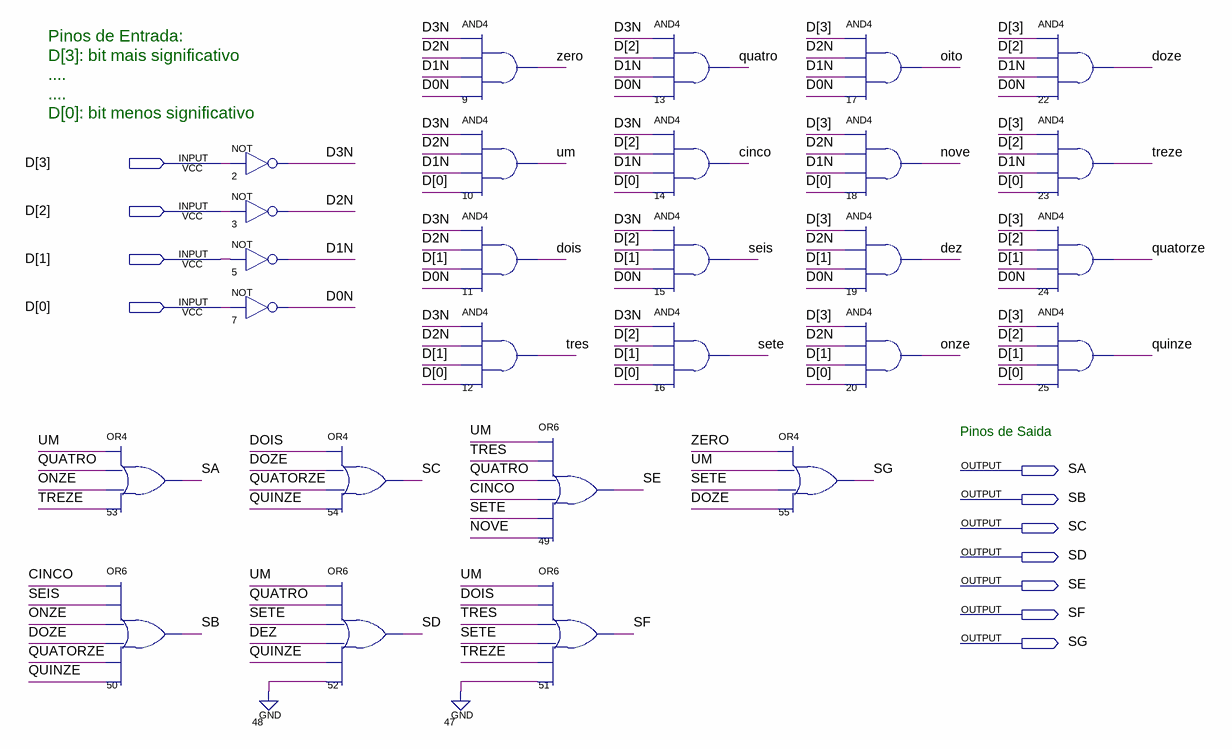
[diagram p0: schematic sheet]
// Quartus schematic exercicio.bdf as structural Verilog: 27 symbols, 11 pins
module exercicio (
  input  [3:0] D,
  output SA,
  output SB,
  output SC,
  output SD,
  output SE,
  output SF,
  output SG
);

  wire cinco, D0N, D1N, D2N, D3N, dez, dois, doze, nove, oito, onze, quatorze, quatro, quinze, seis, sete,
       tres, treze, um, zero;

  or u_53 (SA, um, quatro, onze, treze);
  or u_50 (SB, cinco, seis, onze, doze, quatorze, quinze);
  not u_2 (D3N, D[3]);
  not u_3 (D2N, D[2]);
  not u_5 (D1N, D[1]);
  not u_7 (D0N, D[0]);
  or u_54 (SC, dois, doze, quatorze, quinze);
  or u_52 (SD, um, quatro, sete, dez, quinze, 1'b0);
  and u_9 (zero, D3N, D2N, D1N, D0N);
  and u_10 (um, D3N, D2N, D1N, D[0]);
  and u_11 (dois, D3N, D2N, D[1], D0N);
  and u_12 (tres, D3N, D2N, D[1], D[0]);
  or u_49 (SE, um, tres, quatro, cinco, sete, nove);
  or u_51 (SF, um, dois, tres, sete, treze, 1'b0);
  and u_13 (quatro, D3N, D[2], D1N, D0N);
  and u_14 (cinco, D3N, D[2], D1N, D[0]);
  and u_15 (seis, D3N, D[2], D[1], D0N);
  and u_16 (sete, D3N, D[2], D[1], D[0]);
  or u_55 (SG, zero, um, sete, doze);
  and u_17 (oito, D[3], D2N, D1N, D0N);
  and u_18 (nove, D[3], D2N, D1N, D[0]);
  and u_19 (dez, D[3], D2N, D[1], D0N);
  and u_20 (onze, D[3], D2N, D[1], D[0]);
  and u_22 (doze, D[3], D[2], D1N, D0N);
  and u_23 (treze, D[3], D[2], D1N, D[0]);
  and u_24 (quatorze, D[3], D[2], D[1], D0N);
  and u_25 (quinze, D[3], D[2], D[1], D[0]);

  // Notes on the sheet:
  //   Pinos de Entrada:
  //   D[3]: bit mais significativo
  //   ....
  //   ....
  //   D[0]: bit menos significativo
  //   Pinos de Saida
endmodule
